# EAGLE schematic potinho (EAGLE 6.1)
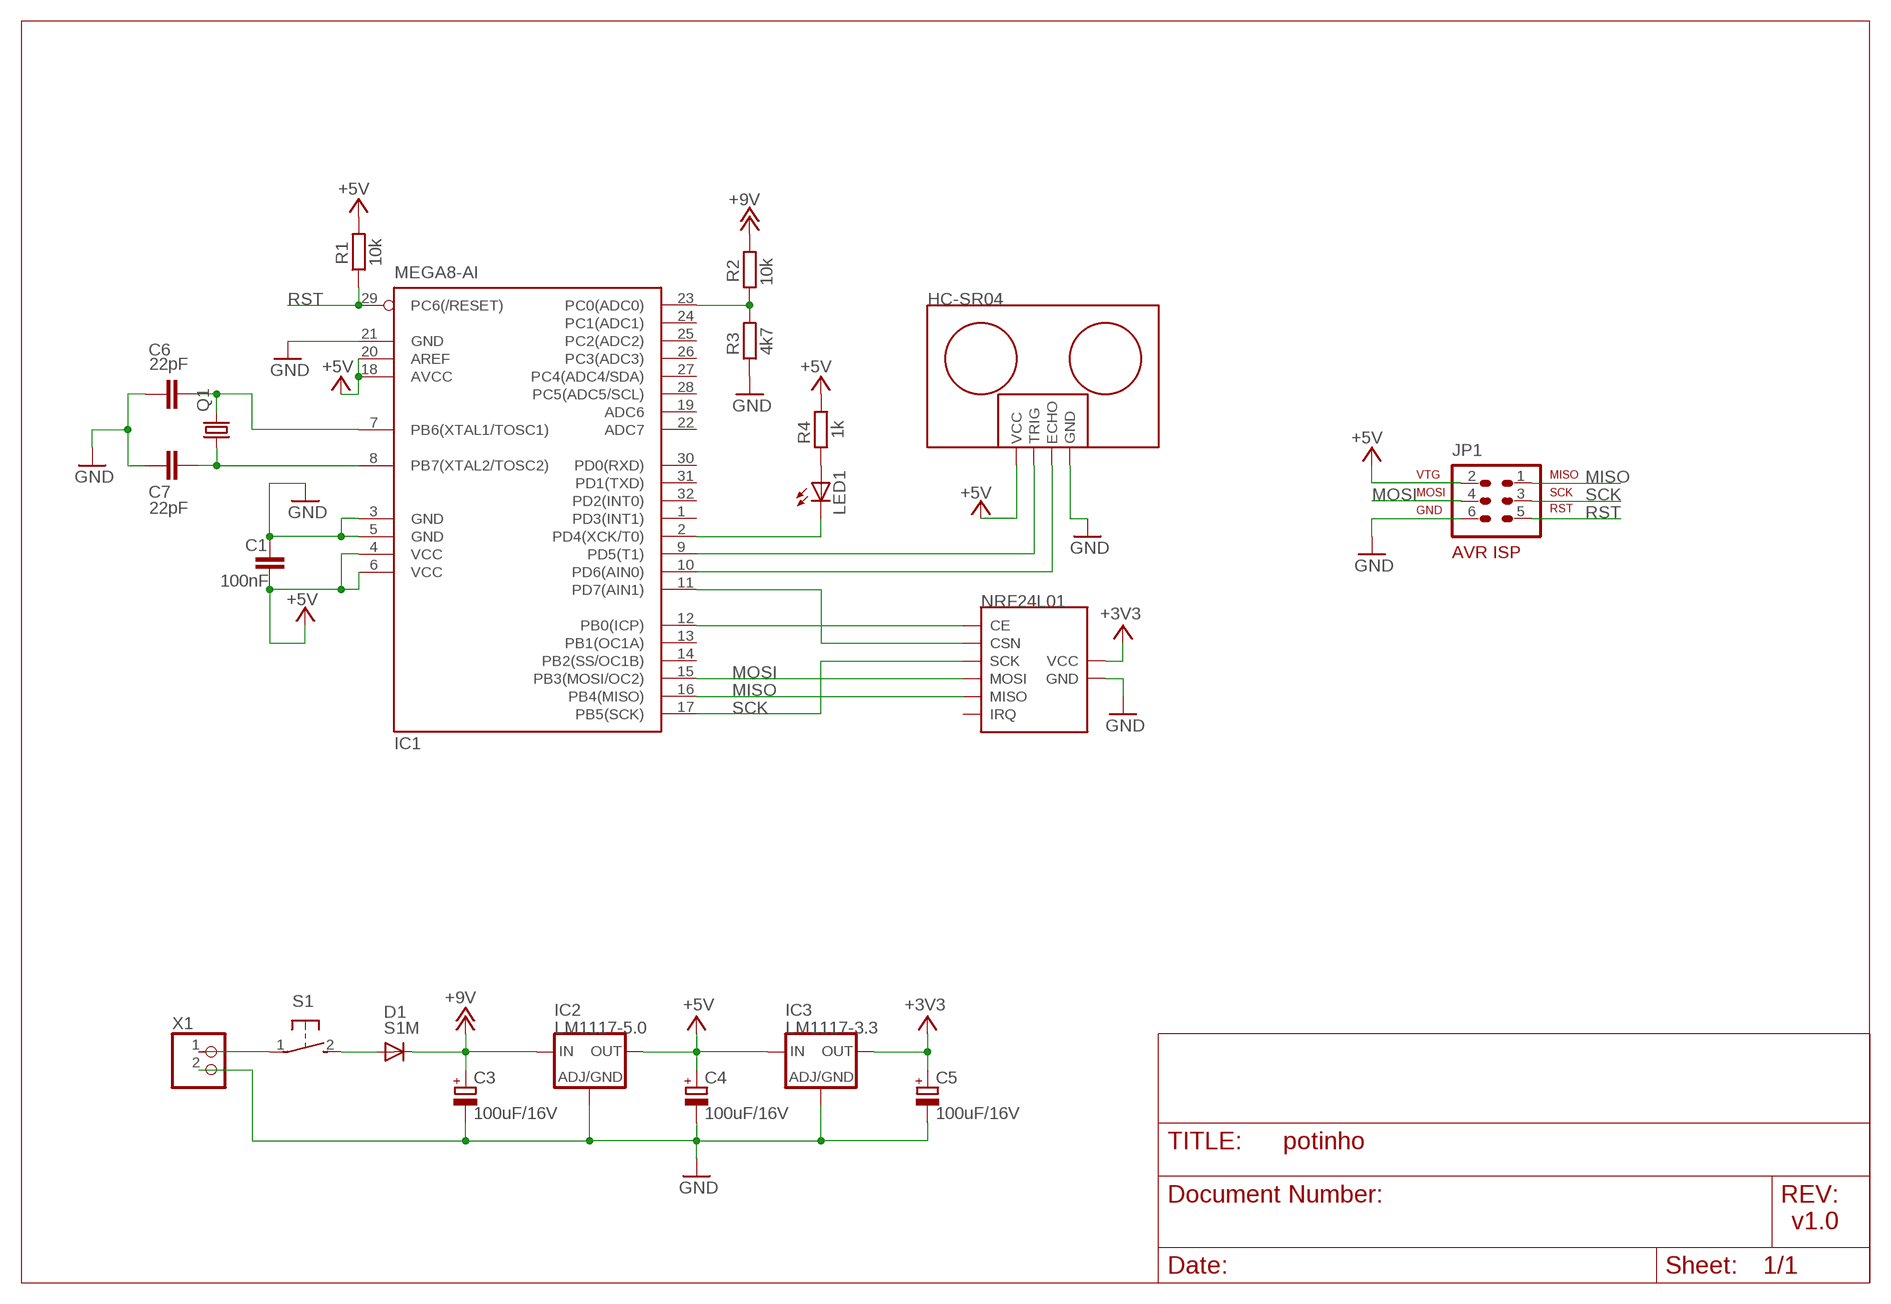
[diagram p0: schematic, sheet 1]

## Parts
C1  100nF  C-EUC0805K  [C0805K]
C3  100uF/16V  CPOL-EUPD  [PANASONIC_D]
C4  100uF/16V  CPOL-EUPD  [PANASONIC_D]
C5  100uF/16V  CPOL-EUPD  [PANASONIC_D]
C6  22pF  C-EUC0805K  [C0805K]
C7  22pF  C-EUC0805K  [C0805K]
D1  S1M  [DO-214AC]
IC1  MEGA8-AI  [TQFP32-08]
IC2  LM1117-5.0  LM1117S  [SOT223]
IC3  LM1117-3.3  LM1117S  [SOT223]
IC4  NRF24L01  NRF24L01-MODULE  [NRF24L01-MODULE]
IC31  HC-SR04  [1X04]
JP1  AVR-ISP-6  [AVR-ISP-6]
LED1  LED3MM  [LED3MM]
Q1  CRYSTALHC49UP  [HC49UP]
R1  10k  R-EU_R0805  [R0805]
R2  10k  R-EU_7  [0207/7]
R3  4k7  R-EU_7  [0207/7]
R4  1k  R-EU_7  [0207/7]
S1  31-XX  [B3F-31XX]
X1  W237-102  [W237-102]

## Nets
+3V3: C5.+ IC3.2(OUT) IC3.4(OUT) IC4.2(VCC)
+5V: C1.2 C4.+ IC1.4(VCC) IC1.6(VCC) IC1.18(AVCC) IC1.20(AREF) IC2.2(OUT) IC2.4(OUT) IC3.3(IN) IC31.1(VCC) JP1.2(VTG) R1.2 R4.2
+12V: C3.+ D1.C IC2.3(IN) R2.2 ; supply symbol labelled +9V
GND: C1.1 C3.- C4.- C5.- C6.1 C7.1 IC1.3(GND) IC1.5(GND) IC1.21(GND) IC2.1(ADJ) IC3.1(ADJ) IC4.1(GND) IC31.4(GND) JP1.6(GND) R3.1 X1.2
MISO: IC1.16(PB4(MISO)) IC4.7(MISO) JP1.1(MISO)
MOSI: IC1.15(PB3(MOSI/OC2)) IC4.6(MOSI) JP1.4(MOSI)
N$1: D1.A S1.2(S)
N$2: IC1.12(PB0(ICP)) IC4.3(CE)
N$3: IC1.23(PC0(ADC0)) R2.1 R3.2
N$4: IC1.11(PD7(AIN1)) IC4.4(CSN)
N$5: C7.2 IC1.8(PB7(XTAL2/TOSC2)) Q1.1
N$6: C6.2 IC1.7(PB6(XTAL1/TOSC1)) Q1.2
N$7: IC1.9(PD5(T1)) IC31.2(TRIG)
N$8: IC1.10(PD6(AIN0)) IC31.3(ECHO)
N$9: S1.1(P) X1.1
N$10: IC1.2(PD4(XCK/T0)) LED1.K(C)
N$11: LED1.A R4.1
RST: IC1.29(PC6(/RESET)) JP1.5(RST) R1.1
SCK: IC1.17(PB5(SCK)) IC4.5(SCK) JP1.3(SCK)
Unconnected: IC1.1(PD3(INT1)) IC1.13(PB1(OC1A)) IC1.14(PB2(SS/OC1B)) IC1.19(ADC6) IC1.22(ADC7) IC1.24(PC1(ADC1)) IC1.25(PC2(ADC2)) IC1.26(PC3(ADC3)) IC1.27(PC4(ADC4/SDA)) IC1.28(PC5(ADC5/SCL)) IC1.30(PD0(RXD)) IC1.31(PD1(TXD)) IC1.32(PD2(INT0)) IC4.8(IRQ)

## Notes on the sheet
- v1.0

## Library data of the parts
C1 C6 C7 = potinho:C-EU: CAPACITOR, European symbol
C3-C5 = potinho:CPOL-EU: POLARIZED CAPACITOR, European symbol
D1 = potinho:S1M
IC1 = potinho:MEGA8: MICROCONTROLLER 8 Kbytes FLASH, 1 kbytes SRAM, 512 bytes EEPROM, USART, 6-channel 10 bit ADC, 2-channel 8 bit ADC Pin compatible with Atmega48, ATMega88, ATMega168 Source: avr.lbr; MPN: ATMEGA8-16AU; OC_FARNELL: 9171371; OC_NEWARK: 73M8863
IC2 IC3 = potinho:LM1117: Low drop fixed and adjustable positive voltage regulators 1 A Source: http://www.st.com/stonline/products/literature/ds/7194/ld1117axx.pdf
IC4 = potinho:NRF24L01-MODULE
IC31 = potinho:HC-SR04
JP1 = potinho:AVR-ISP-6: AVR ISP-6 Serial Programming Header
LED1 = potinho:LED
Q1 = potinho:CRYSTAL: CRYSTAL
R1-R4 = potinho:R-EU_: RESISTOR, European symbol
S1 = potinho:31-XX: OMRON SWITCH; MPN: B3F-3100; OC_FARNELL: 959704; OC_NEWARK: 36M3582
X1 = potinho:W237-102: WAGO SCREW CLAMP